# Altium schematic sheet baseboard.SchDoc
size A3
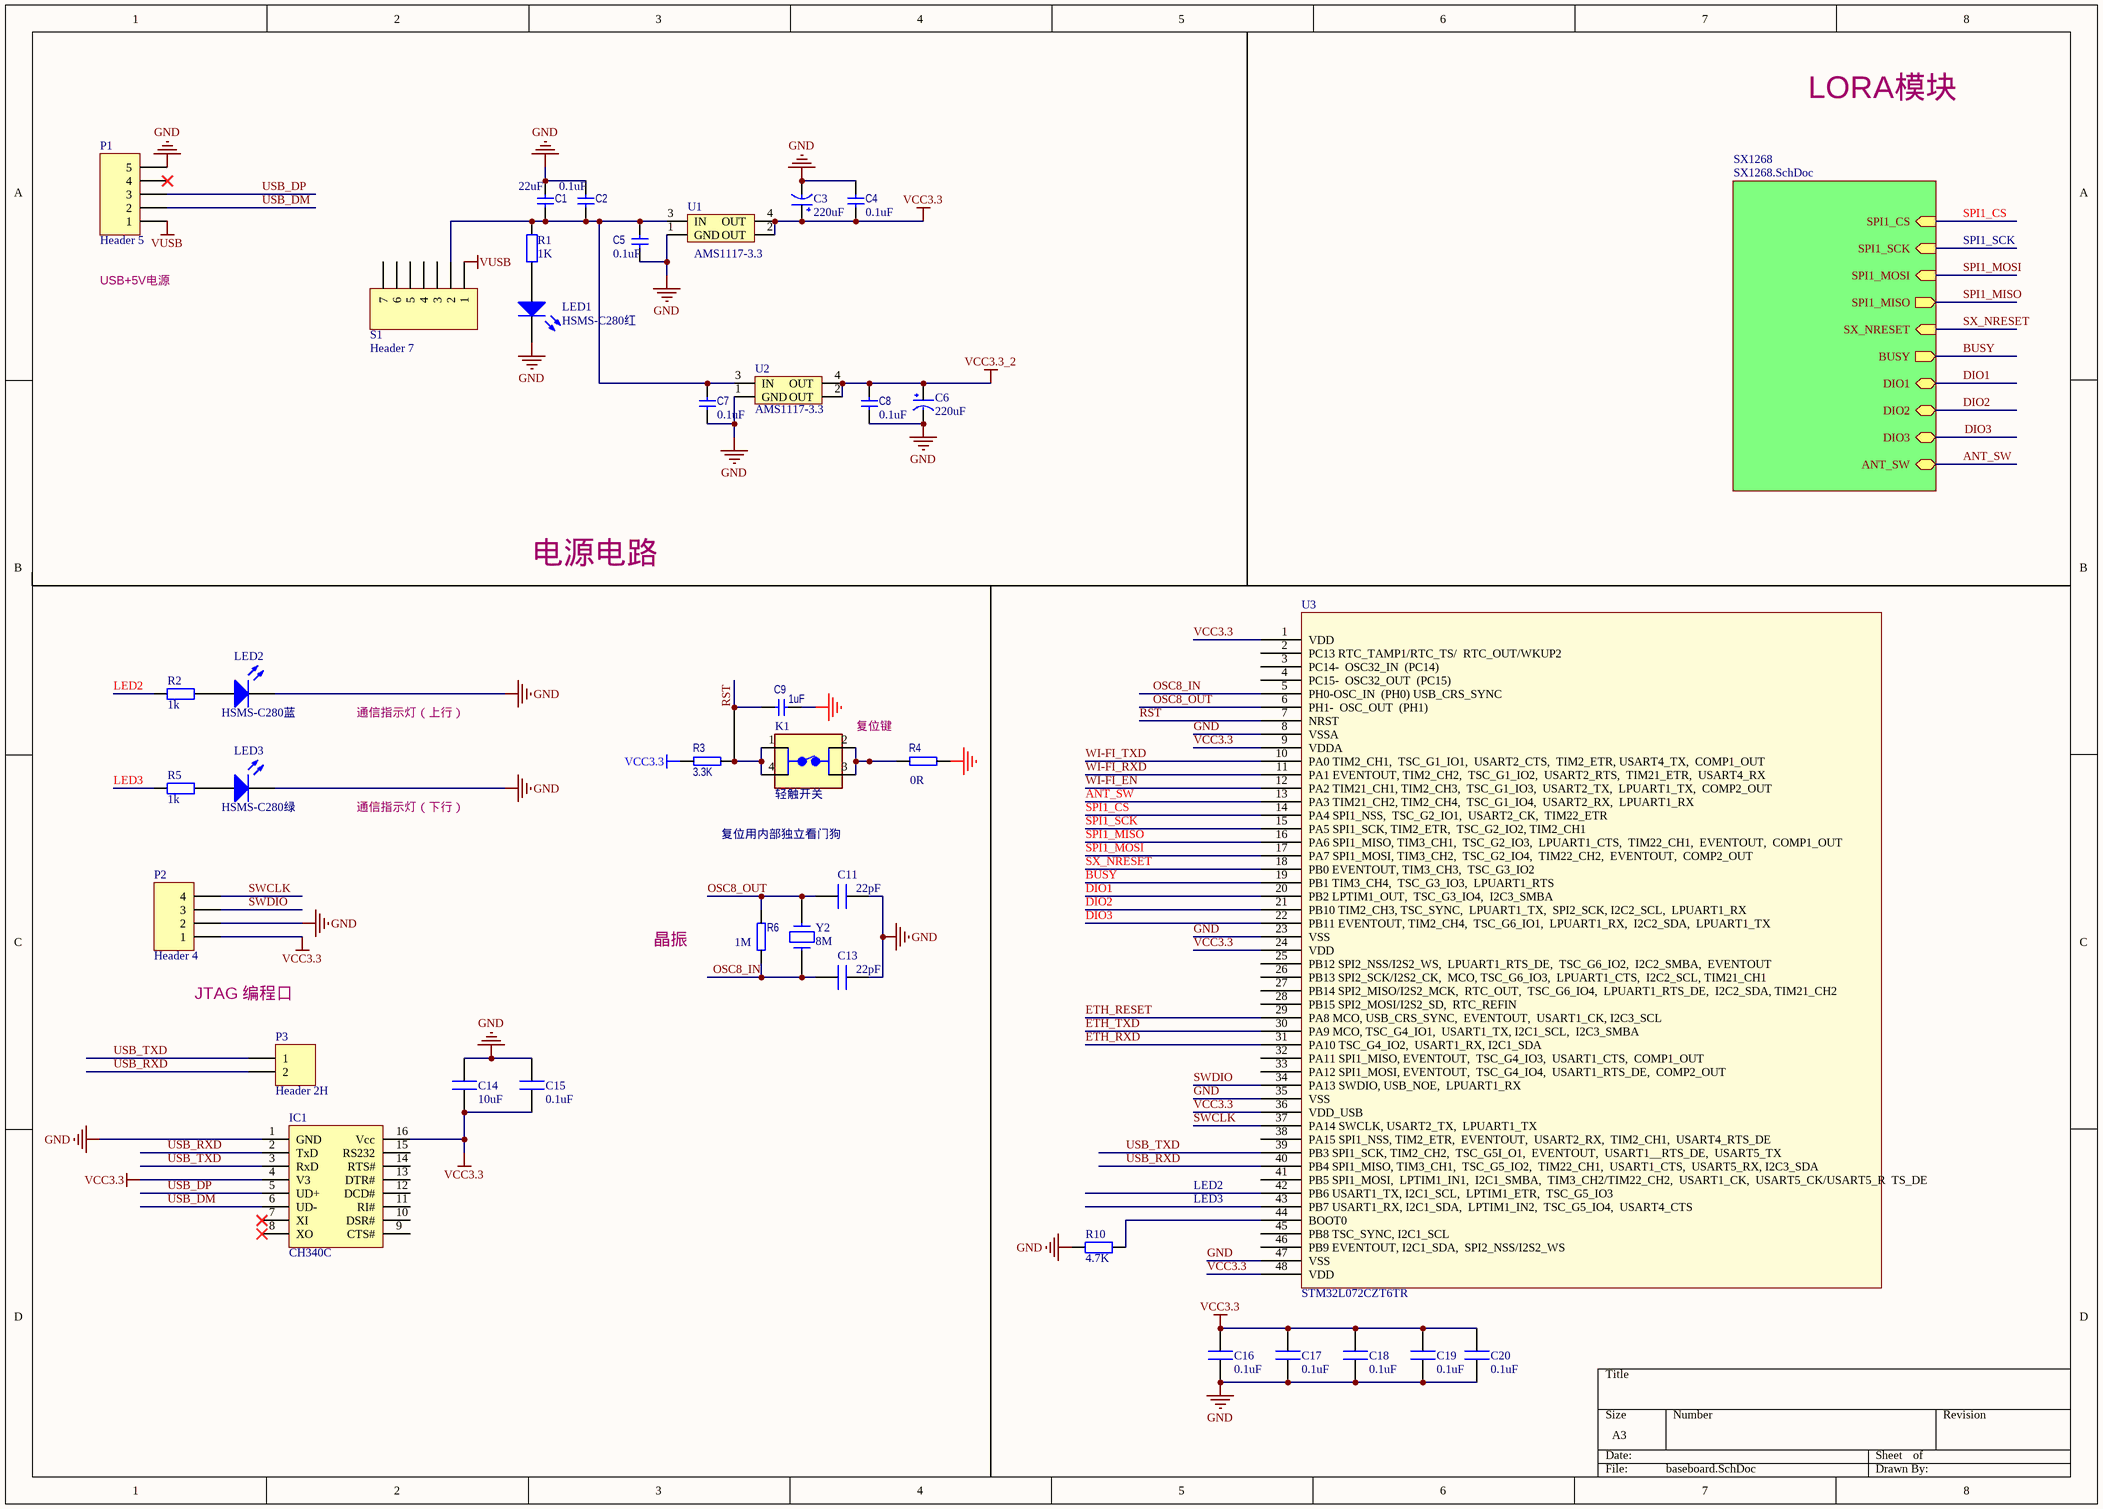
[diagram p0: baseboard.SchDoc]

## Parts
C1  22uF  [C 0603_M]
C2  0.1uF  [C 0603_M]
C3  220uF  [CC6.56.5]
C4  0.1uF  [C 0603_M]
C5  0.1uF  [C 0603_M]
C6  220uF  [CC6.56.5]
C7  0.1uF  [C 0603_M]
C8  0.1uF  [C 0603_M]
C9  1uF  [C 0603_M]
C11  22pF  [C 0603_M]
C13  22pF  [C 0603_M]
C14  10uF  [C 0603_M]
C15  0.1uF  [C 0603_M]
C16  0.1uF  [C 0603_M]
C17  0.1uF  [C 0603_M]
C18  0.1uF  [C 0603_M]
C19  0.1uF  [C 0603_M]
C20  0.1uF  [C 0603_M]
IC1  CH340C  [SOP16_M]
K1  轻触开关  [SW4SM-4R5X4R5]
LED1  HSMS-C280红  [LED_DIP_1]
LED2  HSMS-C280蓝  [LED_DIP_1]
LED3  HSMS-C280绿  [LED_DIP_1]
P1  Header 5  [USB-MICRO_D]
P2  Header 4  [HDR1X4]
P3  Header 2H  [HDR2.54-LI-2P]
R1  1K  [0603R]
R2  1k  [0603R]
R3  3.3K  [0603R]
R4  0R  [0603R]
R5  1k  [0603R]
R6  1M  [0603R]
R10  4.7K  [0603R]
S1  Header 7  [7脚3档开关]
U1  AMS1117-3.3  [AMS1117]
U2  AMS1117-3.3  [AMS1117]
U3  STM32L072CZT6TR  [LQFP48_L]
Y2  8M  [OSC3225]

## Sub-sheets
SX1268 = SX1268.SchDoc: SPI1_CS (in), SPI1_SCK (in), SPI1_MOSI (in), SPI1_MISO (out), SX_NRESET (in), BUSY (out), DIO1 (bidir), DIO2 (bidir), DIO3 (bidir), ANT_SW (bidir)

## Nets
GND: C1.1 C2.1 C3.2(GND) C4.2 C5.1 C6.2(GND) C7.1 C8.2 C9.2 C11.2 C13.2 C14.1 C15.2 C16.1 C17.1 C18.1 C19.1 C20.1 IC1.1(GND) LED1.2(K) LED2.2(K) LED3.2(K) P1.5 P2.2 R4.2 R10.1 U1.1(GND) U2.1(GND) U3.8(VSSA) U3.23(VSS) U3.35(VSS) U3.47(VSS)
VCC3.3: C3.1(VCC) C4.1 C14.2 C15.1 C16.2 C17.2 C18.2 C19.2 C20.2 IC1.4(V3) IC1.16(Vcc) P2.1 R3.1 U1.2(OUT) U1.4(OUT) U3.1(VDD) U3.9(VDDA) U3.24(VDD) U3.36(VDD_USB) U3.48(VDD)
VCC3.3_2: C6.1(VCC) C8.1 U2.2(OUT) U2.4(OUT)
VUSB: P1.1 S1.1
ANT_SW: U3.13(PA3_TIM21_CH2,_TIM2_CH4,__TSC_G1_IO4,__USART2_RX,__LPUART1_RX) ; sheet SX1268/ANT_SW
BUSY: U3.19(PB1_TIM3_CH4,__TSC_G3_IO3,__LPUART1_RTS) ; sheet SX1268/BUSY
DIO1: U3.20(PB2_LPTIM1_OUT,__TSC_G3_IO4,__I2C3_SMBA) ; sheet SX1268/DIO1
DIO2: U3.21(PB10_TIM2_CH3,_TSC_SYNC,__LPUART1_TX,__SPI2_SCK,_I2C2_SCL,__LPUART1_RX) ; sheet SX1268/DIO2
DIO3: U3.22(PB11_EVENTOUT,_TIM2_CH4,__TSC_G6_IO1,__LPUART1_RX,__I2C2_SDA,__LPUART1_TX) ; sheet SX1268/DIO3
ETH_RESET: U3.29(PA8_MCO,_USB_CRS_SYNC,__EVENTOUT,__USART1_CK,_I2C3_SCL)
ETH_RXD: U3.31(PA10_TSC_G4_IO2,__USART1_RX,_I2C1_SDA)
ETH_TXD: U3.30(PA9_MCO,_TSC_G4_IO1,__USART1_TX,_I2C1_SCL,__I2C3_SMBA)
LED2: R2.1 U3.42(PB6_USART1_TX,_I2C1_SCL,__LPTIM1_ETR,__TSC_G5_IO3)
LED3: R5.1 U3.43(PB7_USART1_RX,_I2C1_SDA,__LPTIM1_IN2,__TSC_G5_IO4,__USART4_CTS)
OSC8_IN: C13.1 R6.2 U3.5(PH0-OSC_IN__(PH0)_USB_CRS_SYNC) Y2.2
OSC8_OUT: C11.1 R6.1 U3.6(PH1-__OSC_OUT__(PH1)) Y2.1
RST: C9.1 K1.1 K1.4 R3.2 U3.7(NRST)
SPI1_CS: U3.14(PA4_SPI1_NSS,__TSC_G2_IO1,__USART2_CK,__TIM22_ETR) ; sheet SX1268/SPI1_CS
SPI1_MISO: U3.16(PA6_SPI1_MISO,_TIM3_CH1,__TSC_G2_IO3,__LPUART1_CTS,__TIM22_CH1,__EVENTOUT,__COMP1_OUT) ; sheet SX1268/SPI1_MISO
SPI1_MOSI: U3.17(PA7_SPI1_MOSI,_TIM3_CH2,__TSC_G2_IO4,__TIM22_CH2,__EVENTOUT,__COMP2_OUT) ; sheet SX1268/SPI1_MOSI
SPI1_SCK: U3.15(PA5_SPI1_SCK,_TIM2_ETR,__TSC_G2_IO2,_TIM2_CH1) ; sheet SX1268/SPI1_SCK
SWCLK: P2.4 U3.37(PA14_SWCLK,_USART2_TX,__LPUART1_TX)
SWDIO: P2.3 U3.34(PA13_SWDIO,_USB_NOE,__LPUART1_RX)
SX_NRESET: U3.18(PB0_EVENTOUT,_TIM3_CH3,__TSC_G3_IO2) ; sheet SX1268/SX_NRESET
USB_DM: IC1.6(UD-) P1.2
USB_DP: IC1.5(UD+) P1.3
USB_RXD: IC1.2(TxD) P3.2 U3.40(PB4_SPI1_MISO,_TIM3_CH1,__TSC_G5_IO2,__TIM22_CH1,__USART1_CTS,__USART5_RX,_I2C3_SDA)
USB_TXD: IC1.3(RxD) P3.1 U3.39(PB3_SPI1_SCK,_TIM2_CH2,__TSC_G5I_O1,__EVENTOUT,__USART1__RTS_DE,__USART5_TX)
WI-FI_EN: U3.12(PA2_TIM21_CH1,_TIM2_CH3,__TSC_G1_IO3,__USART2_TX,__LPUART1_TX,__COMP2_OUT)
WI-FI_RXD: U3.11(PA1_EVENTOUT,_TIM2_CH2,__TSC_G1_IO2,__USART2_RTS,__TIM21_ETR,__USART4_RX)
WI-FI_TXD: U3.10(PA0_TIM2_CH1,__TSC_G1_IO1,__USART2_CTS,__TIM2_ETR,_USART4_TX,__COMP1_OUT)
NetC1_2: C1.2 C2.2 C5.2 C7.2 R1.2 S1.2 U1.3(IN) U2.3(IN)
NetK1_2: K1.2 K1.3 R4.1
NetLED1_1: LED1.1(A) R1.1
NetLED2_1: LED2.1(A) R2.2
NetLED3_1: LED3.1(A) R5.2
NetR10_2: R10.2 U3.44(BOOT0)

Not connected (* = marked no-connect by the designer): IC1 7(XI)* 8(XO)* 9(CTS#) 10(DSR#) 11(RI#) 12(DCD#) 13(DTR#) 14(RTS#) 15(RS232); P1 4*; S1 3 4 5 6 7; U3 2(PC13_RTC_TAMP1/RTC_TS/__RTC_OUT/WKUP2) 3(PC14-__OSC32_IN__(PC14)) 4(PC15-__OSC32_OUT__(PC15)) 25(PB12_SPI2_NSS/I2S2_WS,__LPUART1_RTS_DE,__TSC_G6_IO2,__I2C2_SMBA,__EVENTOUT) 26(PB13_SPI2_SCK/I2S2_CK,__MCO,_TSC_G6_IO3,__LPUART1_CTS,__I2C2_SCL,_TIM21_CH1) 27(PB14_SPI2_MISO/I2S2_MCK,__RTC_OUT,__TSC_G6_IO4,__LPUART1_RTS_DE,__I2C2_SDA,_TIM21_CH2) 28(PB15_SPI2_MOSI/I2S2_SD,__RTC_REFIN) 32(PA11_SPI1_MISO,_EVENTOUT,__TSC_G4_IO3,__USART1_CTS,__COMP1_OUT) 33(PA12_SPI1_MOSI,_EVENTOUT,__TSC_G4_IO4,__USART1_RTS_DE,__COMP2_OUT) 38(PA15_SPI1_NSS,_TIM2_ETR,__EVENTOUT,__USART2_RX,__TIM2_CH1,__USART4_RTS_DE) 41(PB5_SPI1_MOSI,__LPTIM1_IN1,__I2C1_SMBA,__TIM3_CH2/TIM22_CH2,__USART1_CK,__USART5_CK/USART5_R__TS_DE) 45(PB8_TSC_SYNC,_I2C1_SCL) 46(PB9_EVENTOUT,_I2C1_SDA,__SPI2_NSS/I2S2_WS)

## Notes on the sheet
- LORA模块
- USB+5V电源
- 电源电路
- 通信指示灯（上行）
- 复位键
- 通信指示灯（下行）
- 复位用内部独立看门狗
- 晶振
- JTAG 编程口

## Library data of the parts
C1 C2 C4 C5 C7-C9 = ProE.tmp_22p_13
  C1: Value: 22uF
  C2 C4 C5 C7 C8: Value: 0.1uF
C3 C6 = CAP_1
C11 C13-C20 = 普通贴片电容: Capacitor
  C11 C13: Value: 22pF
  C14: Value: 10uF
  C15-C20: Value: 0.1uF
IC1 = CH340G: 串口转USB; 版权归属: 源创客; BOM名称: 串口转USB; 学习资源: www.ooocke.com
LED1-LED3 = HSMS-C280: Miniature Chip LED, Red; LuminousIntensity: 2.5mcd (Minimum).; PCB_Layout: Complies with manufacturer's recommendation.; Published: 11-Dec-2002; DatasheetDocument: 7-Mar-2002; PackageDocument: 07-Mar-2002; PackageReference: 1.0X0.5X0.4; Publisher: Altium Limited; LED_Colour: Red; ComponentLink1Description: Manufacturer Link; ComponentLink1URL: http://www.agilent.com/; ComponentLink2Description: Datasheet; ComponentLink2URL: http://cp.literature.agilent.com/litweb/pdf/5988-5890EN.pdf
P1 = Header 5: Header, 5-Pin; LatestRevisionDate: 17-Jul-2002; LatestRevisionNote: Re-released for DXP Platform.; Publisher: Altium Limited
P2 = Header 4: Header, 4-Pin; LatestRevisionDate: 17-Jul-2002; LatestRevisionNote: Re-released for DXP Platform.; Publisher: Altium Limited
P3 = Header 2H: Header, 2-Pin, Right Angle; LatestRevisionDate: 17-Jul-2002; LatestRevisionNote: Re-released for DXP Platform.; Publisher: Altium Limited
R1 = Res2: Resistor; Published: 8-Jun-2000; LatestRevisionDate: 17-Jul-2002; LatestRevisionNote: Re-released for DXP Platform.; PackageReference: AXIAL-0.4; Publisher: Altium Limited; PackageDescription: Axial Device, Thru-Hole; 2 Leads; 0.4 in Pin Spacing; Value: 1K
R2 R5 R10 = Resistor: Resistor SMD - IEC symbol version; LatestRevisionDate: 27-Jul-20  -  Semtech
  R2 R5: Value: 1k
  R10: Value: 4.7K
R3 R4 R6 = ProE.tmp_10k_66
  R4: Value: 0R
  R6: Value: 1M
S1 = Header 7: Header, 7-Pin; LatestRevisionDate: 17-Jul-2002; LatestRevisionNote: Re-released for DXP Platform.; Publisher: Altium Limited
U1 U2 = AMS1117
Y2 = CRYSTAL: Value: 8M